# EasyEDA schematic schematic_easyeda.json
TITLE: Modified Hangfa Discovery Q2 Electronics; REV: 1.0; Date: 2024-12-17; Sheet: 1/1; Drawn By: Ricardo B. Sousa; Company: INESC TEC
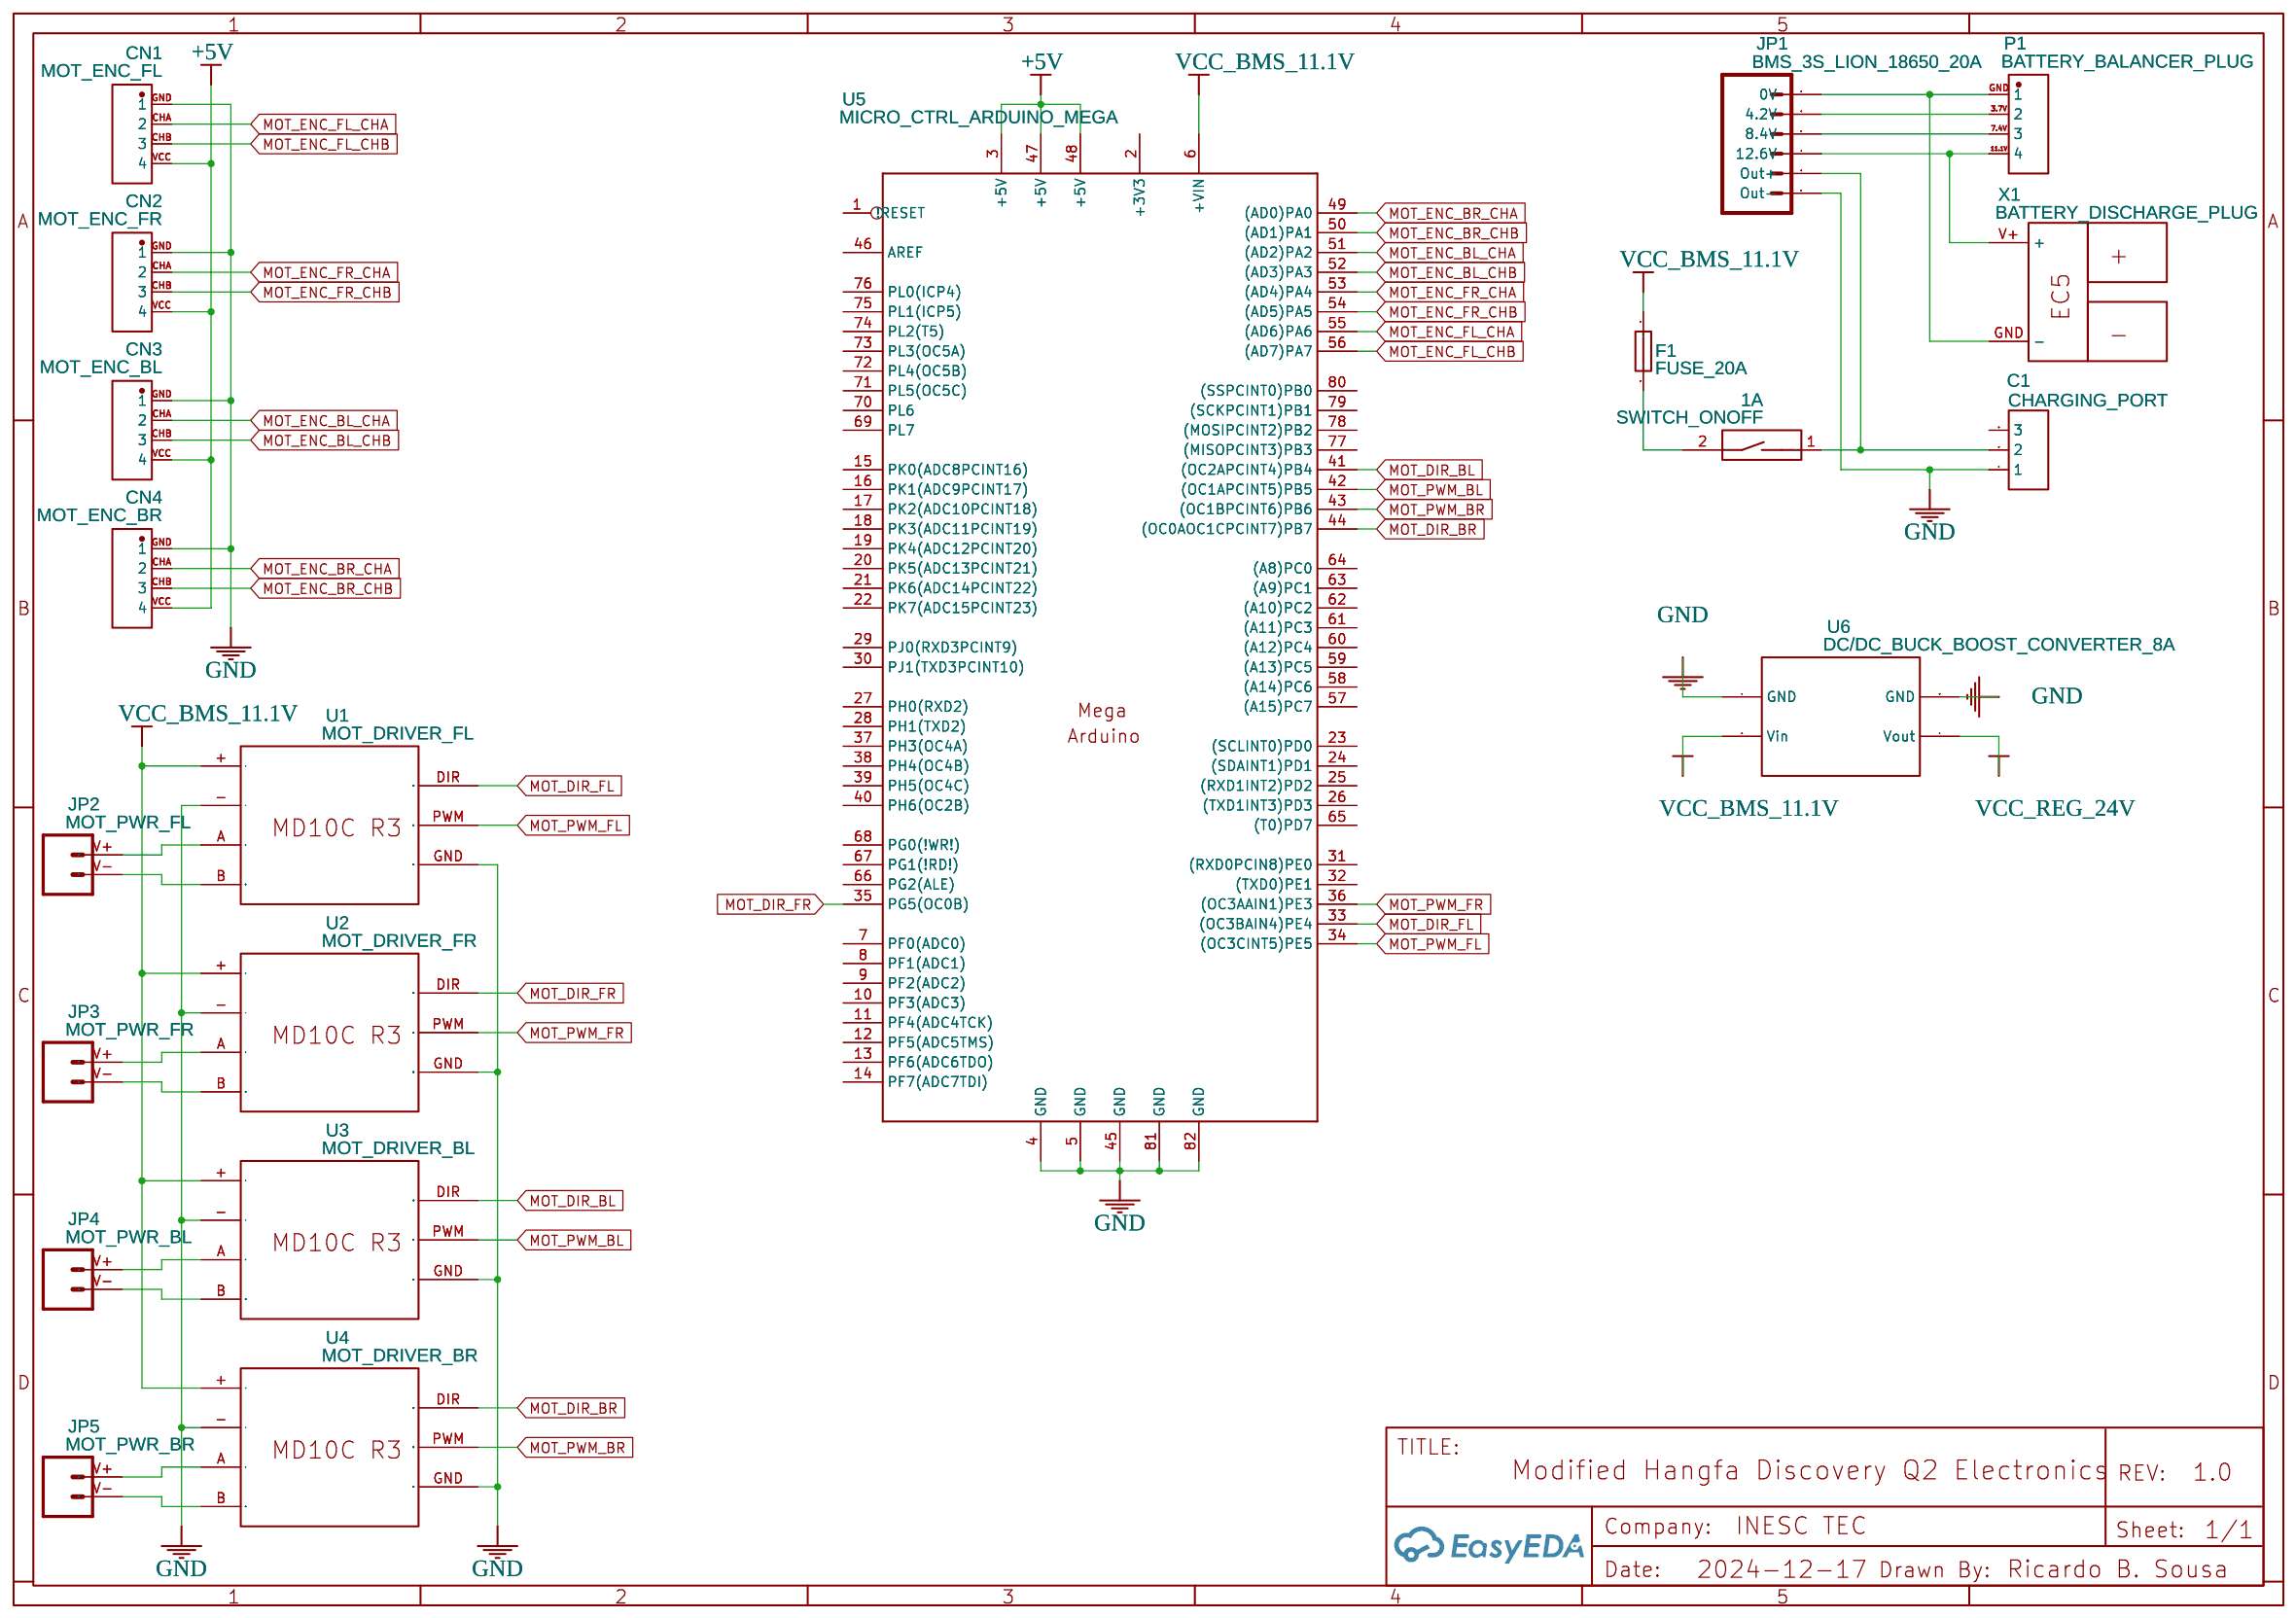
[diagram p0: schematic sheet]

## Parts
1A  SWITCH_ONOFF  [DIP SWITCH 6 SWITCHES]
C1  CHARGING_PORT  [HDR-F-2.54_1X3]
CN1  MOT_ENC_FL  [JST-XH2.54 4P]
CN2  MOT_ENC_FR  [JST-XH2.54 4P]
CN3  MOT_ENC_BL  [JST-XH2.54 4P]
CN4  MOT_ENC_BR  [JST-XH2.54 4P]
F1  FUSE_20A  [FUSE-SMD_LITTELFUSE-0326025]
JP1  BMS_3S_LION_18650_20A  [MY BMS-3S-20A]
JP2  MOT_PWR_FL  [MOLEX-1X2]
JP3  MOT_PWR_FR  [MOLEX-1X2]
JP4  MOT_PWR_BL  [MOLEX-1X2]
JP5  MOT_PWR_BR  [MOLEX-1X2]
P1  BATTERY_BALANCER_PLUG  [CONN-TH_4P-P2.50-XH2.54-4P]
U1  MOT_DRIVER_FL  [MD10C-R3]
U2  MOT_DRIVER_FR  [MD10C-R3]
U3  MOT_DRIVER_BL  [MD10C-R3]
U4  MOT_DRIVER_BR  [MD10C-R3]
U5  MICRO_CTRL_ARDUINO_MEGA  [MEGA_ARDUINO]
U6  DC/DC_BUCK_BOOST_CONVERTER_8A  [DC-DC CONVERTER]
X1  BATTERY_DISCHARGE_PLUG  [EC5]

## Library data of the parts
1A = Switch: Manufacturer: DIP; Manufacturer Part: DIP switchEI-08; Supplier Part: C90019; Contributor: victor390; libConvert: Yes; Add into BOM: Yes
C1 = HDR-F-2.54_1x3: Supplier Part: C146690; Supplier: LCSC; Contributor: Neal
CN1-CN4 = JST-XH2.54 4P: Supplier: CQRobot; link: https://www.amazon.fr/dp/B01EQGNZ2I/?coliid=IQPWZUUK7M1P0&colid=2CFFEVMK4YZ12&ref_=lv_ov_lig_dp_it_im&th=1; Contributor: marierigal4
F1 = Fuse: Supplier: LCSC; Supplier Part: C178977; Manufacturer: Littelfuse(美国力特); Manufacturer Part: 0326025.MXP; Contributor: ld.alex; JLCPCB Part Class: Extended Part
JP1 = MY BMS-3S-20A: Contributor: SparkFun
JP2-JP5 = M02POLAR: Contributor: prbiphone
P1 = XH-2.54-4P: Contributor: LCSC; Supplier: LCSC; Supplier Part: C9900003933; Manufacturer: null
U1-U4 = MD10C-R3: Manufacturer: Cytron; Supplier: RS-Online; Contributor: misterphogg
U5 = MEGAARDUINO_1
U6 = DC-DC Converter: Contributor: hongyam
X1 = EC5: Contributor: CDKruger

## Nets
+5V: CN1.VCC(4) CN2.VCC(4) CN3.VCC(4) CN4.VCC(4) U5.3(+5V) U5.47(+5V) U5.48(+5V)
GND: C1.1 CN1.GND(1) CN2.GND(1) CN3.GND(1) CN4.GND(1) JP1.6(Out-) U1.- U1.GND U2.- U2.GND U3.- U3.GND U4.- U4.GND U5.4(GND) U5.5(GND) U5.45(GND) U5.81(GND) U5.82(GND) U6.1(GND) U6.3(GND)
VCC_BMS_11.1V: F1.1 U1.+ U2.+ U3.+ U4.+ U5.6(+VIN) U6.2(Vin)
VCC_REG_24V: U6.4(Vout)
MOT_DIR_BL: U3.DIR U5.41((OC2APCINT4)PB4)
MOT_DIR_BR: U4.DIR U5.44((OC0AOC1CPCINT7)PB7)
MOT_DIR_FL: U1.DIR U5.33((OC3BAIN4)PE4)
MOT_DIR_FR: U2.DIR U5.35(PG5(OC0B))
MOT_ENC_BL_CHA: CN3.CHA(2) U5.51((AD2)PA2)
MOT_ENC_BL_CHB: CN3.CHB(3) U5.52((AD3)PA3)
MOT_ENC_BR_CHA: CN4.CHA(2) U5.49((AD0)PA0)
MOT_ENC_BR_CHB: CN4.CHB(3) U5.50((AD1)PA1)
MOT_ENC_FL_CHA: CN1.CHA(2) U5.55((AD6)PA6)
MOT_ENC_FL_CHB: CN1.CHB(3) U5.56((AD7)PA7)
MOT_ENC_FR_CHA: CN2.CHA(2) U5.53((AD4)PA4)
MOT_ENC_FR_CHB: CN2.CHB(3) U5.54((AD5)PA5)
MOT_PWM_BL: U3.PWM U5.42((OC1APCINT5)PB5)
MOT_PWM_BR: U4.PWM U5.43((OC1BPCINT6)PB6)
MOT_PWM_FL: U1.PWM U5.34((OC3CINT5)PE5)
MOT_PWM_FR: U2.PWM U5.36((OC3AAIN1)PE3)
Net-(1A-1): 1A.1 C1.2 JP1.5(Out+)
Net-(1A-2): 1A.2 F1.2
Net-(JP1-1): JP1.1(0V) P1.GND(1) X1.GND(-)
Net-(JP1-2): JP1.2(4.2V) P1.3.7V(2)
Net-(JP1-3): JP1.3(8.4V) P1.7.4V(3)
Net-(JP1-4): JP1.4(12.6V) P1.11.1V(4) X1.V+(+)
Net-(JP2-V+): JP2.V+(2) U1.A
Net-(JP2-V-): JP2.V-(1) U1.B
Net-(JP3-V+): JP3.V+(2) U2.A
Net-(JP3-V-): JP3.V-(1) U2.B
Net-(JP4-V+): JP4.V+(2) U3.A
Net-(JP4-V-): JP4.V-(1) U3.B
Net-(JP5-V+): JP5.V+(2) U4.A
Net-(JP5-V-): JP5.V-(1) U4.B

Not connected (* = marked no-connect by the designer): C1 3; U5 1(!RESET) 2(+3V3) 7(PF0(ADC0)) 8(PF1(ADC1)) 9(PF2(ADC2)) 10(PF3(ADC3)) 11(PF4(ADC4TCK)) 12(PF5(ADC5TMS)) 13(PF6(ADC6TDO)) 14(PF7(ADC7TDI)) 15(PK0(ADC8PCINT16)) 16(PK1(ADC9PCINT17)) 17(PK2(ADC10PCINT18)) 18(PK3(ADC11PCINT19)) 19(PK4(ADC12PCINT20)) 20(PK5(ADC13PCINT21)) 21(PK6(ADC14PCINT22)) 22(PK7(ADC15PCINT23)) 23((SCLINT0)PD0) 24((SDAINT1)PD1) 25((RXD1INT2)PD2) 26((TXD1INT3)PD3) 27(PH0(RXD2)) 28(PH1(TXD2)) 29(PJ0(RXD3PCINT9)) 30(PJ1(TXD3PCINT10)) 31((RXD0PCIN8)PE0) 32((TXD0)PE1) 37(PH3(OC4A)) 38(PH4(OC4B)) 39(PH5(OC4C)) 40(PH6(OC2B)) 46(AREF) 57((A15)PC7) 58((A14)PC6) 59((A13)PC5) 60((A12)PC4) 61((A11)PC3) 62((A10)PC2) 63((A9)PC1) 64((A8)PC0) 65((T0)PD7) 66(PG2(ALE)) 67(PG1(!RD!)) 68(PG0(!WR!)) 69(PL7) 70(PL6) 71(PL5(OC5C)) 72(PL4(OC5B)) 73(PL3(OC5A)) 74(PL2(T5)) 75(PL1(ICP5)) 76(PL0(ICP4)) 77((MISOPCINT3)PB3) 78((MOSIPCINT2)PB2) 79((SCKPCINT1)PB1) 80((SSPCINT0)PB0)
